# EAGLE design nRF24-MultiPro (EAGLE 7.6.0)
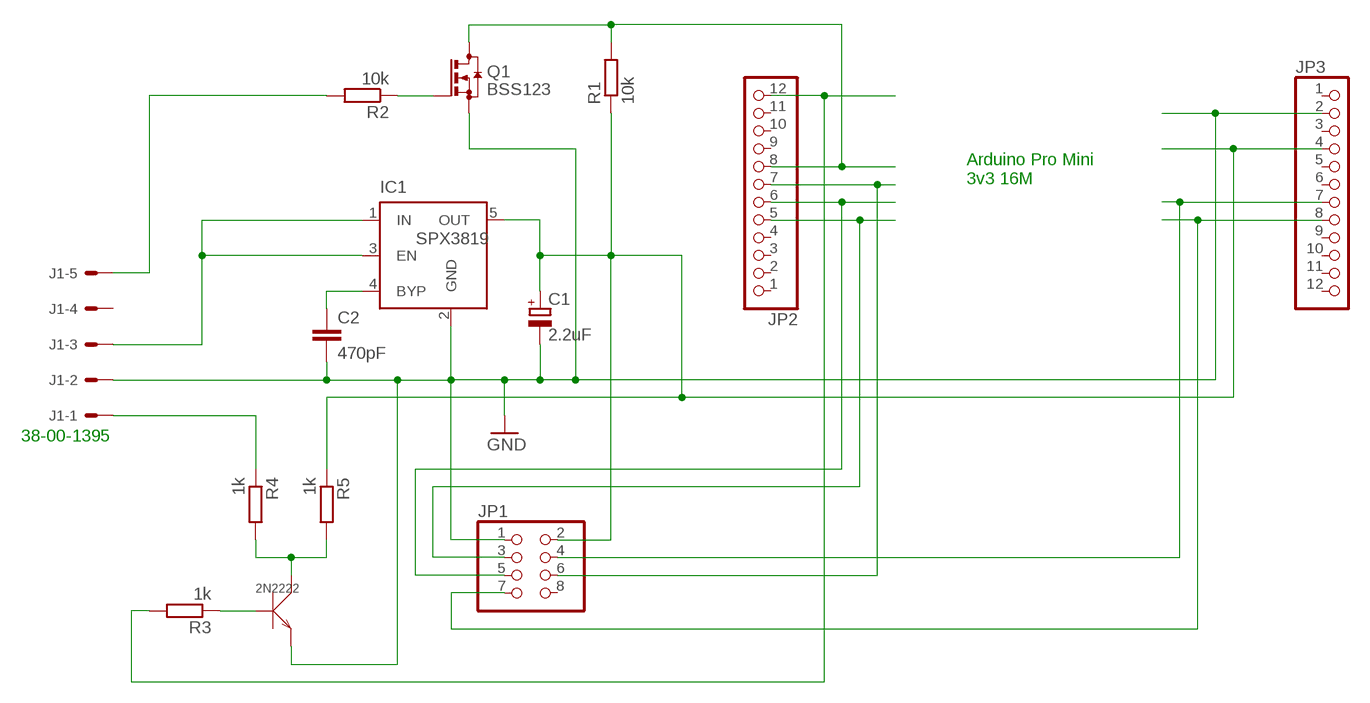
[diagram p0: schematic, sheet 1]

## Parts
2N2222  TRANSISTOR-NPN  [SOT-23]
C1  2.2uF  CPOL-EUA/3216-18W  [A/3216-18W]
C2  470pF  C-EUC0805  [C0805]
IC1  SPX3819  MIC5219XX  [SOT23-5]
J1  22-27-2051-05  [6410-05]
JP1  PINHD-2X4  [2X04]
JP2  PINHD-1X12  [1X12]
JP3  PINHD-1X12  [1X12]
Q1  BSS123  [SOT23]
R1  10k  R-EU_R0805  [R0805]
R2  10k  R-EU_R0805  [R0805]
R3  1k  R-EU_R0805  [R0805]
R4  1k  R-EU_R0805  [R0805]
R5  1k  R-EU_R0805  [R0805]

## Nets
GND: 2N2222.2(E) C1.- C2.2 IC1.2(GND) J1.2 JP1.1 JP3.2 Q1.2(S)
N$1: IC1.1(IN) IC1.3(EN) J1.3
N$2: JP2.8 Q1.3(D) R1.2
N$3: JP1.4 JP3.7
N$4: C1.+ IC1.5(OUT) JP1.2 JP3.4 R1.1 R5.1
N$5: JP1.6 JP2.7
N$6: 2N2222.1(B) R3.1
N$7: Q1.1(G) R2.1
N$8: J1.5 R2.2
N$9: JP1.3 JP2.5
N$10: JP1.5 JP2.6
N$11: JP1.7 JP3.8
N$12: 2N2222.3(C) R4.2 R5.2
N$13: J1.1 R4.1
N$14: C2.1 IC1.4(BYP)
N$16: JP2.12 R3.2
Unconnected: J1.4 JP1.8 JP2.1 JP2.2 JP2.3 JP2.4 JP2.9 JP2.10 JP2.11 JP3.1 JP3.3 JP3.5 JP3.6 JP3.9 JP3.10 JP3.11 JP3.12

## Notes on the sheet
- Arduino Pro Mini
  3v3 16M
- 38-00-1395

## Library data of the parts
2N2222 = Seeed-OPL-Transistor:TRANSISTOR-NPN*: NPN Transistor
C1 = resistor:CPOL-EU: POLARIZED CAPACITOR, European symbol
C2 = resistor:C-EU: CAPACITOR, European symbol
IC1 = v-reg-micrel:MIC5219XX: VOLTAGE REGULATOR; OC_FARNELL: unknown; OC_NEWARK: unknown
J1 = con-molex:22-?-05: CONNECTOR wire to board 2.54 mm (.1 inch) pitch header; OC_FARNELL: unknown; OC_NEWARK: unknown
JP1 = pinhead:PINHD-2X4: PIN HEADER
JP2 JP3 = pinhead:PINHD-1X12: PIN HEADER
Q1 = transistor-small-signal:BSS123: N-CHANNEL MOS FET
R1-R5 = resistor:R-EU_: RESISTOR, European symbol

## Board
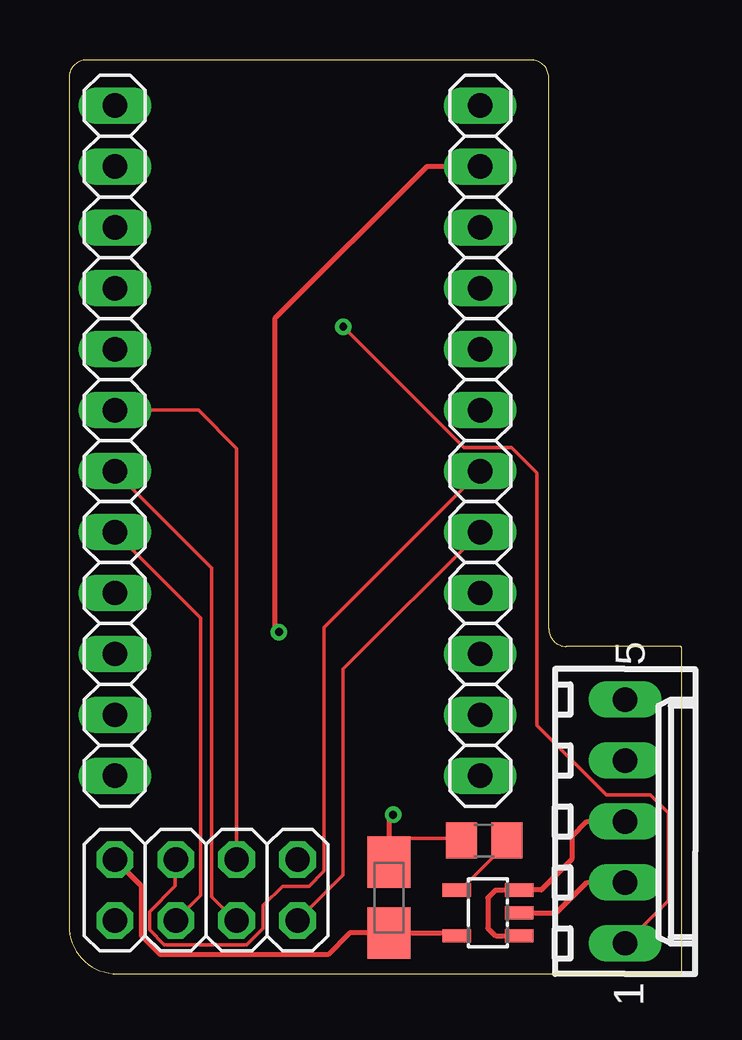
[diagram p1: board, top side]
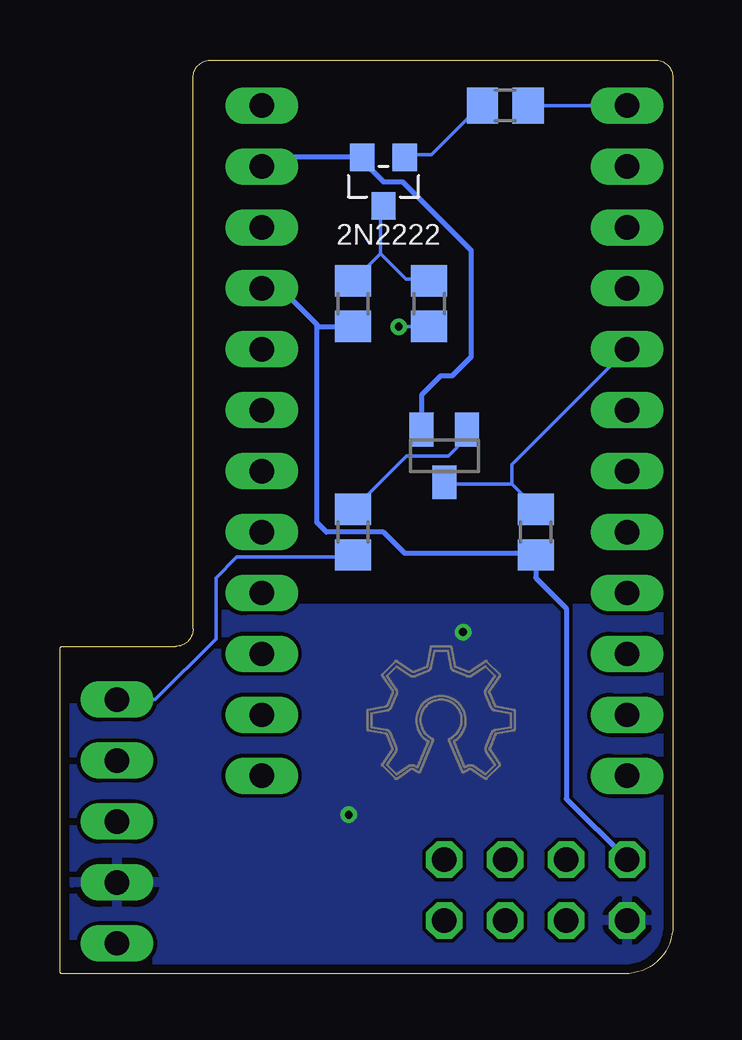
[diagram p2: board, bottom side, seen from below]

Size 25.55 x 38.09 mm. Coordinates in mm from the lower left corner, seen from the top.
Outline: 0,37.37 0,2 arc90 2,0 25.46,0 arc90 25.55,0.1 25.55,13.55 arc90 25.46,13.65 20.73,13.65 arc-90 20,14.38 20,37.37 arc90 19.27,38.09 0.73,38.09 arc90 0,37.37
Copper layers (1*16): Top 0.0356mm / dielectric 1.5011mm / Bottom 0.0356mm
Design rules "LaenPCBOrder": minimum track width 6mil, minimum drill 13mil, track to track 6mil, track to pad 6mil, pad to pad 6mil, via to via 6mil, smd to smd 6mil, copper to edge 15mil, drill to drill 6mil, minimum pad ring 7mil, minimum via ring 7mil, stop-mask expansion 3mil, vias tented up to drill 0mil, thermal gap 10mil

### Footprints (pad centres in the part's own frame; a part is rotated, then mirrored left to right if it is on the bottom)
SOT-23 = smd 1.016 x 1.143: 1 -0.889,-1.016; 2 0.889,-1.016; 3 0,1.016
A/3216-18W = smd 2.15 x 1.8: + 1.475,0; - -1.475,0
C0805 = smd 1.3 x 1.5: 1 -0.95,0; 2 0.95,0
SOT23-5 = smd 0.55 x 1.2: 1 -0.95,-1.3; 2 0,-1.3; 3 0.95,-1.3; 4 0.95,1.3; 5 -0.95,1.3
6410-05 = drill 1.016 long: 1 5.08,0; 2 2.54,0; 3 0,0; 4 -2.54,0; 5 -5.08,0
2X04 = drill 1.016 octagon: 1 -3.81,-1.27; 2 -3.81,1.27; 3 -1.27,-1.27; 4 -1.27,1.27; 5 1.27,-1.27; 6 1.27,1.27; 7 3.81,-1.27; 8 3.81,1.27
1X12 = drill 1.016 long: 1 -13.97,0; 2 -11.43,0; 3 -8.89,0; 4 -6.35,0; 5 -3.81,0; 6 -1.27,0; 7 1.27,0; 8 3.81,0; 9 6.35,0; 10 8.89,0; 11 11.43,0; 12 13.97,0
SOT23 = smd 1 x 1.4: 1 -0.95,-1.1; 2 0.95,-1.1; 3 0,1.1
R0805 = smd 1.3 x 1.5: 1 -0.95,0; 2 0.95,0

### Placement (x,y rotation side)
2N2222  12.06,33.02 180 bottom
C1  13.34,3.17 270 top
C2  17.3,5.56 180 top
IC1  17.46,2.54 90 top
J1  23.18,6.35 270 top
JP1  5.71,3.49 0 top
JP2  1.91,22.23 90 top
JP3  17.14,22.23 270 top
Q1  9.53,21.59 180 bottom
R1  5.71,18.41 90 bottom
R2  13.34,18.41 270 bottom
R3  6.99,36.2 0 bottom
R4  10.16,27.94 90 bottom
R5  13.34,27.94 90 bottom

### Tracks (layer width: path | path; a pad name or v marks a point on that pad's centre or on a via)
GND  (via drill 0.33)
  Top 0.152: 13.41,4.72 C1.- 13.41,5.64 16.31,5.64 C2.2
  Top 0.203: v13.51,6.63 13.34,6.45 C1.- | IC1.2 20.32,2.54 21.59,3.81 J1.2 | JP3.2 14.92,33.66 8.57,27.3 8.57,14.43 v8.75,14.25
  Bottom 0.152: 10.52,22.71 Q1.2 | 12.95,33.98 2N2222.2
  Bottom 0.203: 2N2222.2 16.76,34.04 JP3.2 | 12.95,33.98 12.95,33.91 12.06,33.02 11.27,33.02 8.41,30.16 8.41,25.72 9.21,24.92 9.68,24.92 10.48,24.13 Q1.2
  pour Bottom: 0,0 25.24,0 25.24,15.24 0,15.24
N$1
  Top 0.203: IC1.1 17.78,1.59 17.46,1.91 17.46,3.17 17.78,3.49 IC1.3 19.68,3.49 20.95,4.76 20.95,5.71 21.59,6.35 J1.3
N$2
  Bottom 0.152: 6.71,20.42 9.45,20.42 Q1.3 | 6.71,20.42 5.79,19.51 R1.2 | 6.71,20.42 6.71,21.23 JP2.8
N$3
  Top 0.152: JP3.7 10.64,14.45 10.64,4.29 10,3.65 8.89,3.65 8.1,2.86 8.1,1.91 7.41,1.22 3.96,1.22 3.35,1.83 3.35,2.59 4.42,3.66 4.42,4.72 JP1.4
N$4
  Top 0.152: IC1.5 16.15,1.68 16,1.68 16,1.7
  Top 0.203: 16.05,1.7 16,1.7 C1.+ 11.7,1.7 10.79,0.79 3.81,0.79 3.02,1.59 3.02,3.65 JP1.2
  Bottom 0.152: 5.79,17.53 R1.1
  Bottom 0.203: R1.1 5.71,16.51 4.45,15.24 4.45,7.3 JP1.2 | 5.79,17.53 11.18,17.53 12.06,18.41 14.45,18.41 14.84,18.81 14.84,27.07 | JP3.4 16.35,28.57 14.84,27.07 | 14.84,27.07 14.76,26.99 R5.1
N$5
  Top 0.152: JP2.7 5.4,23.5 6.99,21.91 JP1.6
N$6
  Bottom 0.152: 2N2222.1 11.12,34.14 10.06,34.14 8.08,36.12 R3.1
N$7
  Bottom 0.152: Q1.1 8.57,22.38 9.37,21.59 11.11,21.59 R2.1
N$8
  Bottom 0.152: R2.2 13.41,17.37 18.19,17.37 19.05,16.51 19.05,13.97 21.59,11.43 J1.5
N$9
  Top 0.152: JP1.3 5.49,3.26 5.49,14.83 JP2.5
N$10
  Top 0.152: JP1.5 6.86,2.29 5.94,3.2 5.94,16.92 JP2.6
N$11
  Top 0.152: JP3.8 11.43,12.7 11.43,4.13 JP1.7
N$12
  Bottom 0.152: 12.19,30.02 12.19,32 2N2222.3 | 12.19,30.02 13.26,28.96 R5.2 | 12.19,30.02 11.12,28.96 10.21,28.96 R4.2
N$13  (via drill 0.33)
  Top 0.152: v11.43,26.98 16.46,21.95 18.44,21.95 19.51,20.88 19.51,10.36 22.4,7.47 24.23,7.47 24.99,6.71 24.99,3.05 23.32,1.37 J1.1
  Bottom 0.152: v11.43,26.98 10.21,26.98 R4.1
N$14
  Top 0.152: IC1.4 16.31,3.5 18.29,5.49 C2.1
N$16
  Bottom 0.152: JP2.12 R3.2

### Text on the board
tDocu: nRF24 MultiPro / mozgy - v1.1
bDocu: nRF24 MultiPro / mozgy - v1.1